# EAGLE design bnc_BOB (EAGLE 6.4)
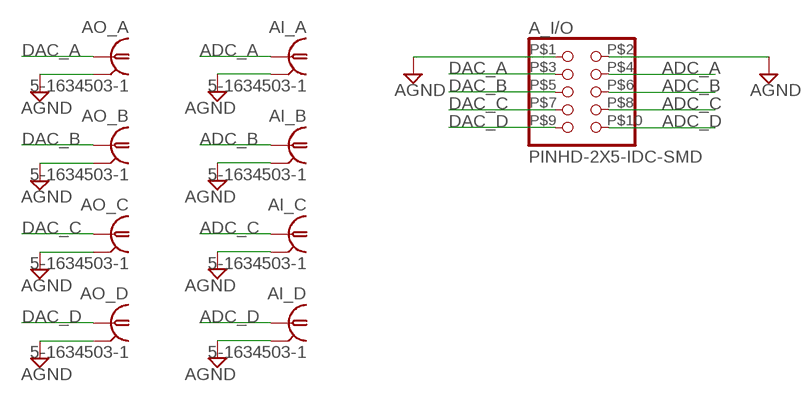
[diagram p0: schematic, sheet 1]

## Parts
A_I/O  PINHD-2X5-IDC-SMD  [2X05-IDC-SMD]
AI_A  5-1634503-1  BN35N61  [B35N61]
AI_B  5-1634503-1  BN35N61  [B35N61]
AI_C  5-1634503-1  BN35N61  [B35N61]
AI_D  5-1634503-1  BN35N61  [B35N61]
AO_A  5-1634503-1  BN35N61  [B35N61]
AO_B  5-1634503-1  BN35N61  [B35N61]
AO_C  5-1634503-1  BN35N61  [B35N61]
AO_D  5-1634503-1  BN35N61  [B35N61]

## Nets
ADC_A: A_I/O.P$4 AI_A.1
ADC_B: A_I/O.P$6 AI_B.1
ADC_C: A_I/O.P$8 AI_C.1
ADC_D: A_I/O.P$10 AI_D.1
AGND: A_I/O.P$1 A_I/O.P$2 AI_A.2 AI_A.3 AI_A.4 AI_A.5 AI_B.2 AI_B.3 AI_B.4 AI_B.5 AI_C.2 AI_C.3 AI_C.4 AI_C.5 AI_D.2 AI_D.3 AI_D.4 AI_D.5 AO_A.2 AO_A.3 AO_A.4 AO_A.5 AO_B.2 AO_B.3 AO_B.4 AO_B.5 AO_C.2 AO_C.3 AO_C.4 AO_C.5 AO_D.2 AO_D.3 AO_D.4 AO_D.5
DAC_A: A_I/O.P$3 AO_A.1
DAC_B: A_I/O.P$5 AO_B.1
DAC_C: A_I/O.P$7 AO_C.1
DAC_D: A_I/O.P$9 AO_D.1

## Library data of the parts
A_I/O = puggleboard:PINHD-2X5; DK: S9185-ND; MN: Sullins; MPN: SBH11-NBPC-D05-SM-BK
AI_A AI_B AI_C AI_D AO_A AO_B AO_C AO_D = puggleboard:BN35N61: BNC CONNECTOR M/A COM www.macom.com distributor Farnell 149-452; DK: A97581-ND; MF: TE Connectivity; MPN: 5-1634503-1; OC_FARNELL: unknown; OC_NEWARK: unknown

## Board
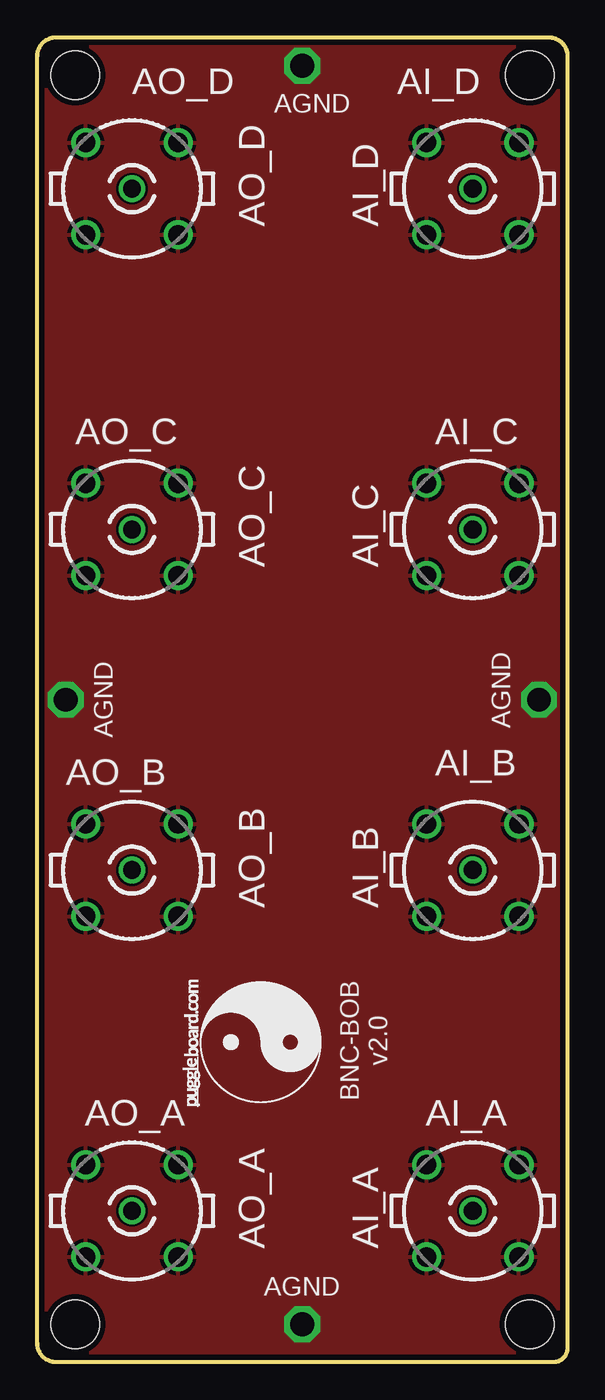
[diagram p1: board, top side]
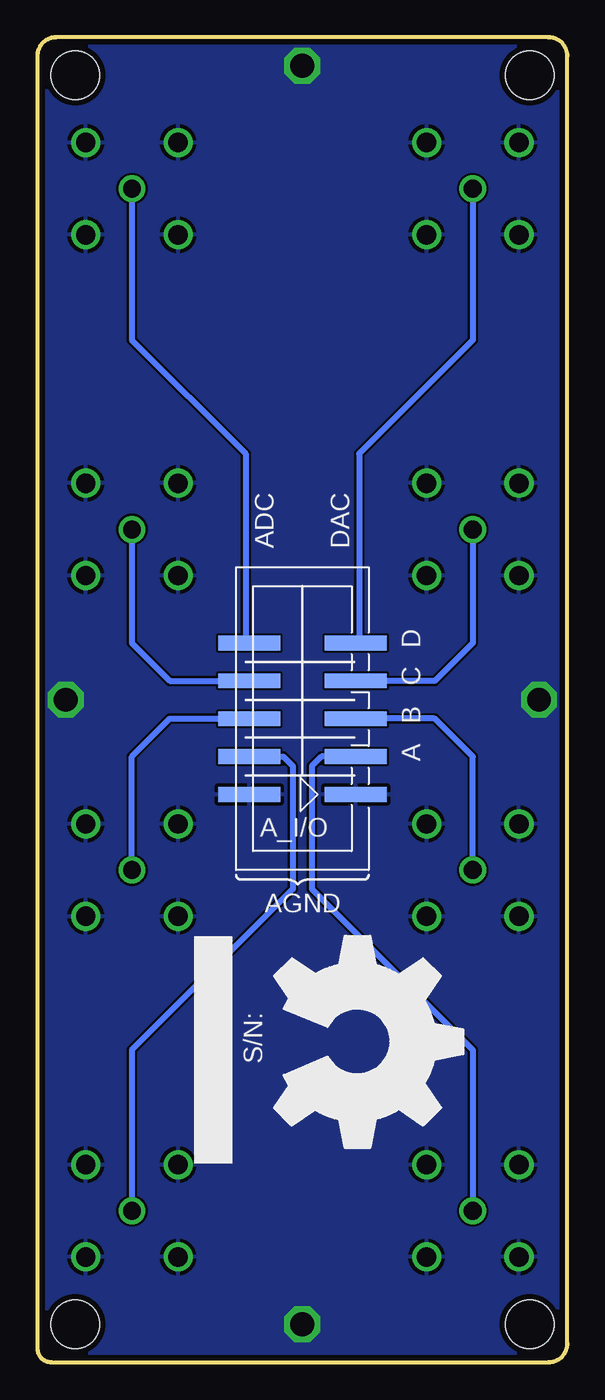
[diagram p2: board, bottom side, seen from below]

Size 35.56 x 88.9 mm. Coordinates in mm from the lower left corner, seen from the top.
Outline: 35.56,87.63 35.56,0.95 arc-90 34.61,0 1.27,0 arc-90 0,1.27 0,87.63 arc-90 1.27,88.9 34.29,88.9 arc-90 35.56,87.63
Copper layers (1*16): Top 0.0356mm / dielectric 1.5011mm / Bottom 0.0356mm
Design rules "LaenPCBOrder": minimum track width 6mil, minimum drill 13mil, track to track 6mil, track to pad 6mil, pad to pad 6mil, via to via 6mil, smd to smd 6mil, copper to edge 15mil, drill to drill 6mil, minimum pad ring 7mil, minimum via ring 7mil, stop-mask expansion 4mil, vias tented up to drill 0mil, thermal gap 10mil
Holes 3.26 mm at 2.54,86.36 33.02,86.36 33.02,2.54 2.54,2.54

### Footprints (pad centres in the part's own frame; a part is rotated, then mirrored left to right if it is on the bottom)
2X05-IDC-SMD = smd 4.153 x 0.991: P$1 -3.575,5.08; P$2 3.575,5.08; P$3 -3.575,2.54; P$4 3.575,2.54; P$5 -3.575,0; P$6 3.575,0; P$7 -3.575,-2.54; P$8 3.575,-2.54; P$9 -3.575,-5.08; P$10 3.575,-5.08
B35N61 = drill 1.2: 1 0,0 | drill 1.3: 2 3.099,3.099; 3 -3.099,3.099; 4 -3.099,-3.099; 5 3.099,-3.099

### Placement (x,y rotation side)
A_I/O  17.78,43.18 180 bottom
AI_A  29.21,10.16 0 top
AI_B  29.21,33.02 0 top
AI_C  29.21,55.88 0 top
AI_D  29.21,78.74 0 top
AO_A  6.35,10.16 0 top
AO_B  6.35,33.02 0 top
AO_C  6.35,55.88 0 top
AO_D  6.35,78.74 0 top
U$1  [PB-LOGO]  19.05,17.14 90 top
U$2  [OSHW_FILLX500_NOTEXT]  19.68,28.57 270 bottom

### Tracks (layer width: path | path; a pad name or v marks a point on that pad's centre or on a via)
ADC_A
  Bottom 0.406: A_I/O.P$4 19.05,40.64 18.41,40.01 18.41,31.75 29.21,20.95 AI_A.1
ADC_B
  Bottom 0.406: AI_B.1 29.21,40.64 26.67,43.18 A_I/O.P$6
ADC_C
  Bottom 0.406: AI_C.1 29.21,48.26 26.67,45.72 A_I/O.P$8
ADC_D
  Bottom 0.406: AI_D.1 29.21,68.58 21.59,60.96 21.59,48.49 A_I/O.P$10
AGND  (via drill 1.6)
  other vias: 17.78,87 33.66,44.45 1.91,44.45 17.78,2.54
  pour Bottom: 0,88.9 35.56,88.9 35.56,0 0,0
  pour Top: 0,88.9 35.56,88.9 35.56,0 0,0
DAC_A
  Bottom 0.406: A_I/O.P$3 16.51,40.64 17.14,40.01 17.14,31.75 6.35,20.95 AO_A.1
DAC_B
  Bottom 0.406: AO_B.1 6.35,40.64 8.89,43.18 A_I/O.P$5
DAC_C
  Bottom 0.406: AO_C.1 6.35,48.26 8.89,45.72 A_I/O.P$7
DAC_D
  Bottom 0.406: AO_D.1 6.35,68.58 13.97,60.96 13.97,48.49 A_I/O.P$9

### Text on the board
tPlace: AGND | AO_D | AI_D | AO_C | AI_C | AGND | AGND | AO_B | AI_B | BNC-BOB / v2.0 | AO_A | AI_A | AGND
bPlace: DAC | ADC | D | C | B | A | AGND | S/N: